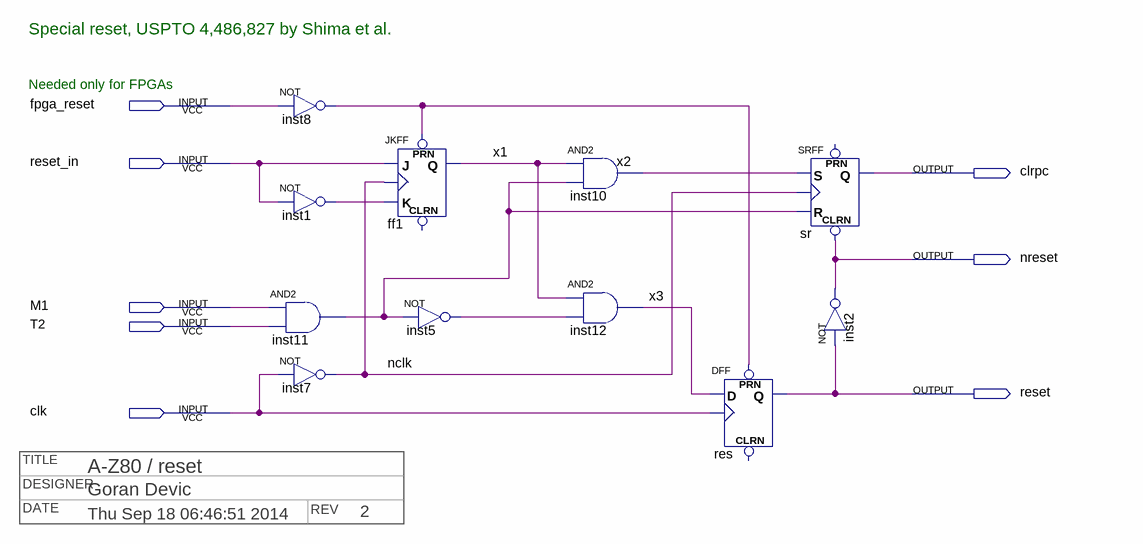
[diagram p0: schematic sheet]
// Quartus schematic resets.bdf as structural Verilog: 11 symbols, 8 pins
// Title block: DATE: Thu Sep 18 06:46:51 2014; DESIGNER: Goran Devic; REV: 2; TITLE: A-Z80 / reset
module resets (
  input  fpga_reset,
  input  reset_in,
  input  M1,
  input  T2,
  input  clk,
  output clrpc,
  output nreset,
  output reset
);

  wire inst1_out, inst5_out, inst8_out, inst11_out, nclk, x1, x2, x3;

  not inst8 (inst8_out, fpga_reset);
  not inst1 (inst1_out, reset_in);
  and inst11 (inst11_out, M1, T2);
  not inst7 (nclk, clk);
  JKFF ff1 (.PRN(inst8_out), .K(inst1_out), .J(reset_in), .CLK(nclk), .Q(x1));  // open: CLRN
  not inst5 (inst5_out, inst11_out);
  and inst10 (x2, x1, inst11_out);
  and inst12 (x3, x1, inst5_out);
  DFF res (.CLK(clk), .D(x3), .PRN(inst8_out), .Q(reset));  // open: CLRN
  SRFF sr (.CLRN(nreset), .S(x2), .R(inst11_out), .CLK(nclk), .Q(clrpc));  // open: PRN
  not inst2 (nreset, reset);

  // Notes on the sheet:
  //   Special reset, USPTO 4,486,827 by Shima et al.
  //   Needed only for FPGAs
endmodule
